# Altium project Knobber.PrjPcb
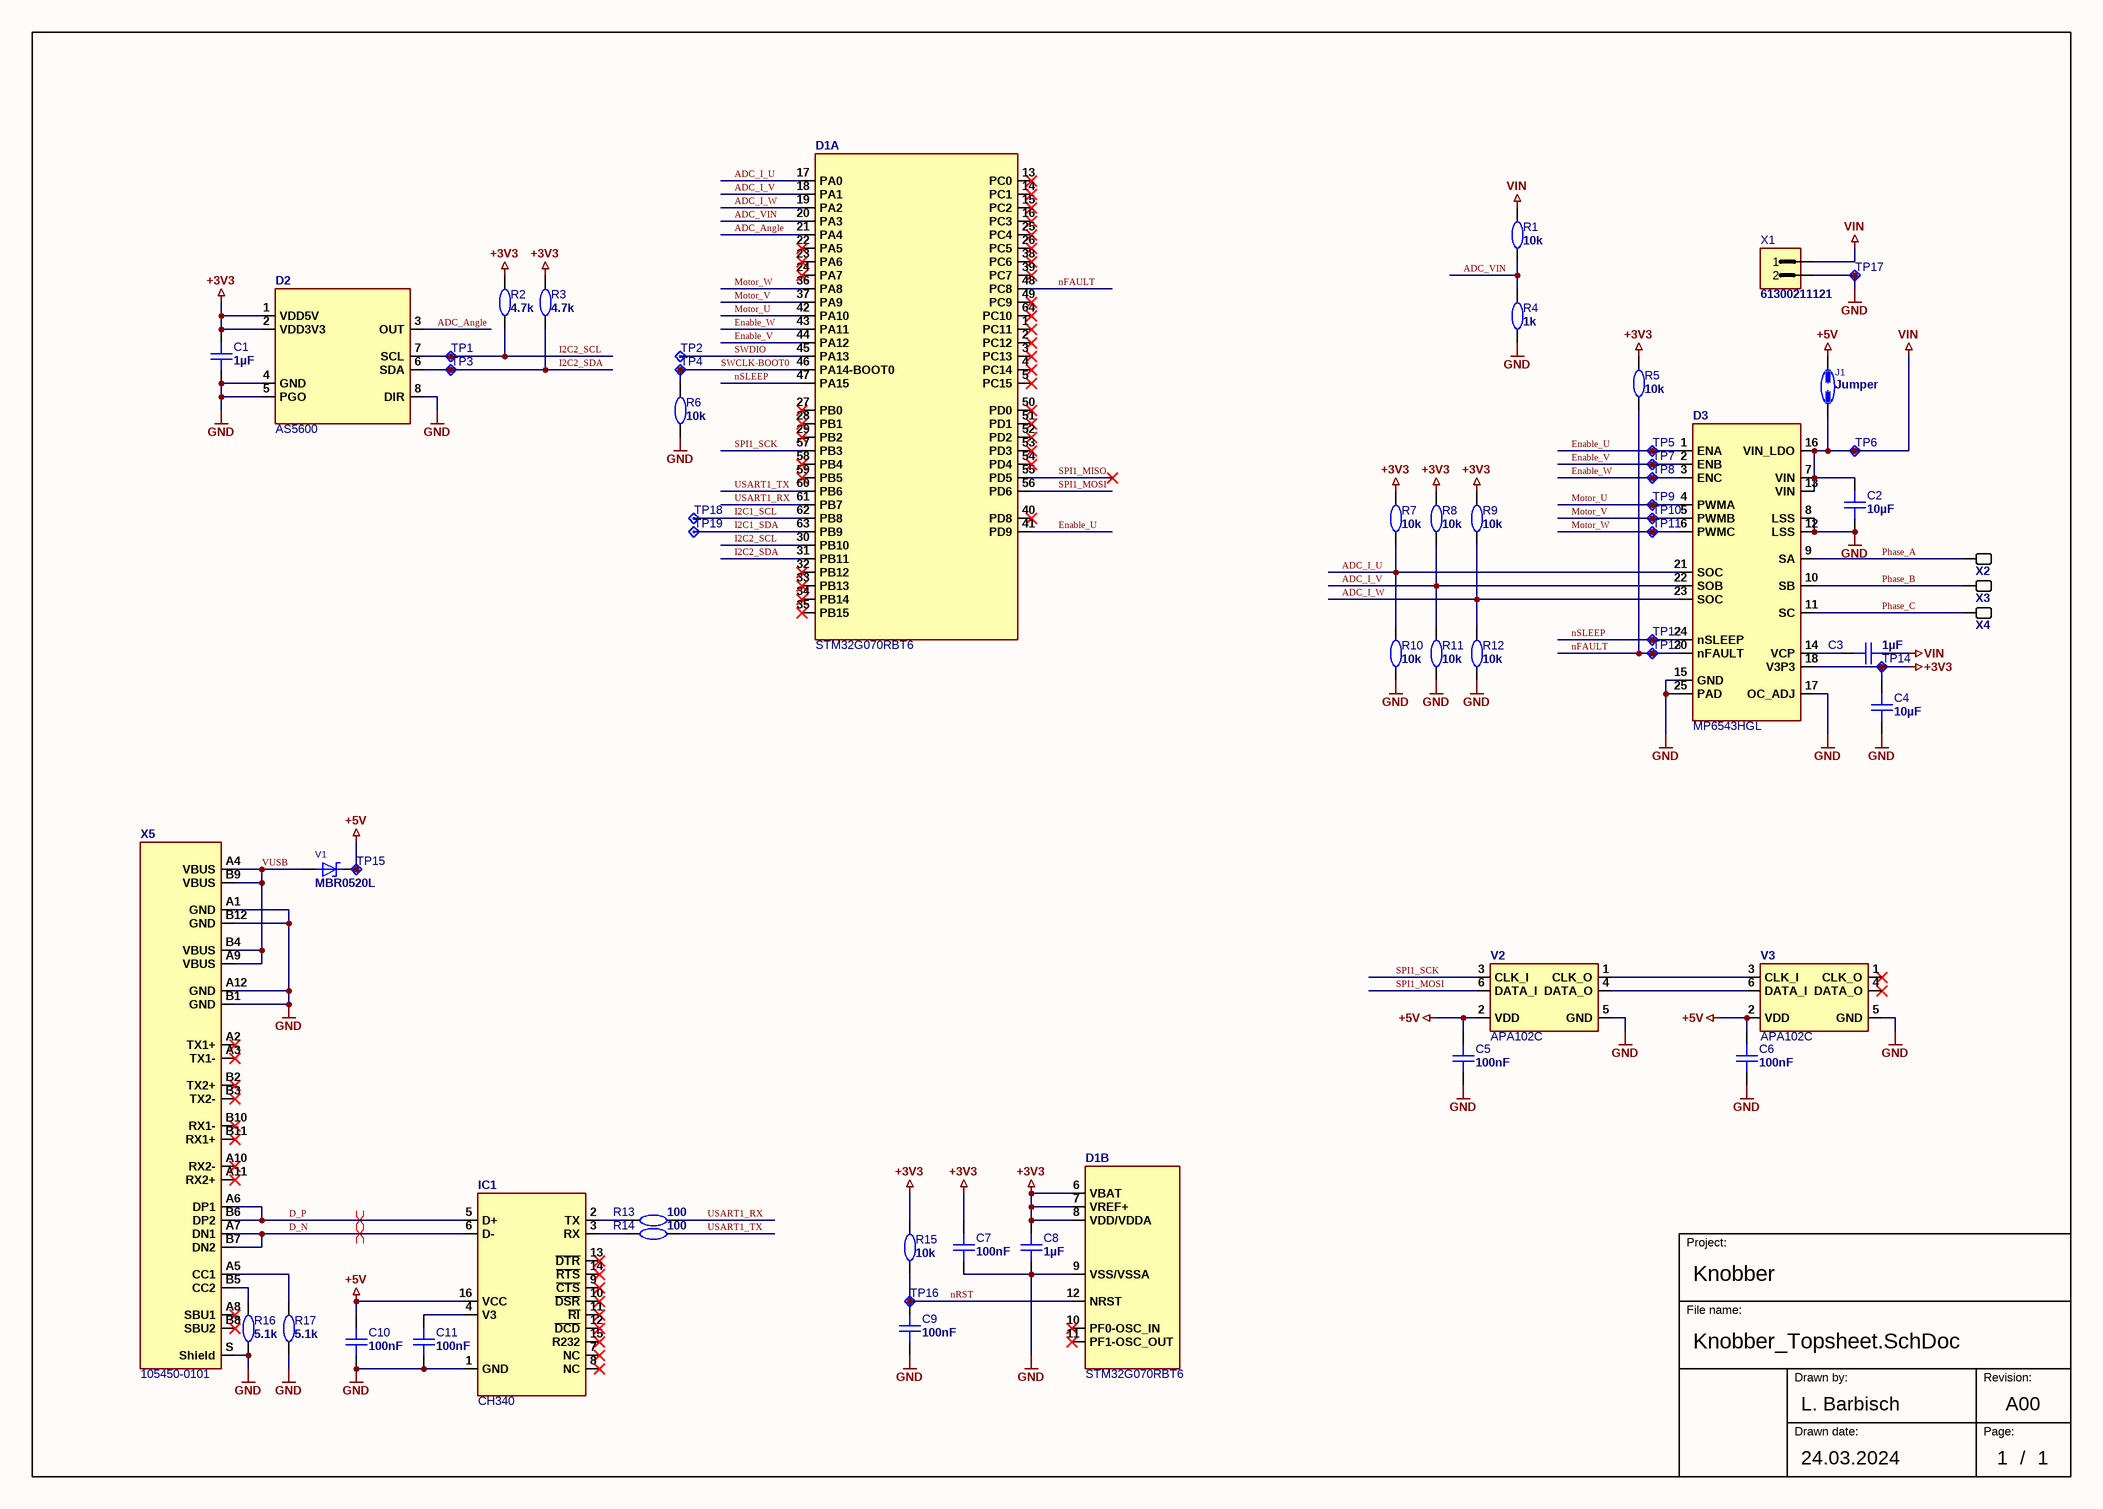
[diagram p0: Knobber_Topsheet.SchDoc]
Schematic_Title: Knobber; Schematic_Revision: A00; Schematic_DrawnDate: 24.03.2024; Schematic_DrawnBy: L. Barbisch; Schematic_DocumentNo: XXXXXXXX; Schematic_CheckedDate: dd.mm.yyyy; Schematic_CheckedBy: C. Sch Checker; Revision: A00; Project: Knobber; PCB_TP_Revision: A; PCB_TP_DocumentNo: XXXXXXXX; PCB_Title: Knobber; PCB_Revision: A; PCB_PartNo: XXX.XXXX; PCB_DrawnDate: dd.mm.yyyy; PCB_DrawnBy: D. Designer; PCB_CheckedDate: dd.mm.yyyy; PCB_CheckedBy: C. PCB Checker; PCB_Assy_DrawnDate: dd.mm.yyyy; PCB_Assy_DrawnBy: A. P. Assy
1 sheet, 60 parts. Net scope: global (net labels, ports and power ports of the same name join across sheets).
Board file: Knobber.PcbDoc

## Sheet Knobber_Topsheet.SchDoc
size A3; SheetNumber: 1; SheetTotal: 1

### Parts
C1  value 1µF  [C-0603_1608_095_L_RF]  (hidden comment: Cap 1u 0603)
C2  value 10µF  [C-1210_3225_230_L_RF]  (hidden comment: CAP 10u 1210)
C3  value 1µF  [C-0603_1608_095_L_RF]  (hidden comment: Cap 1u 0603)
C4  value 10µF  [C-0805_2012_145_L_RF]  (hidden comment: CAP 10u 16V 0805)
C5  value 100nF  [C-0603_1608_095_L_RF]  (hidden comment: Cap 100n 0603)
C6  value 100nF  [C-0603_1608_095_L_RF]  (hidden comment: Cap 100n 0603)
C7  value 100nF  [C-0603_1608_095_L_RF]  (hidden comment: Cap 100n 0603)
C8  value 1µF  [C-0603_1608_095_L_RF]  (hidden comment: Cap 1u 0603)
C9  value 100nF  [C-0603_1608_095_L_RF]  (hidden comment: Cap 100n 0603)
C10  value 100nF  [C-0603_1608_095_L_RF]  (hidden comment: Cap 100n 0603)
C11  value 100nF  [C-0603_1608_095_L_RF]  (hidden comment: Cap 100n 0603)
D1  STM32G070RBT6  [LQFP64_50P1200X1200X160-64N]  (parts A,B of 2)
D2  AS5600  [SOIC8_N_RF]
D3  MP6543HGL  [QFN24_5x7_N_RF]
IC1  CH340  [SOIC16_N_RF]
J1  value Jumper  [J-1206_Solderjumper_2Pin]  (hidden comment: Solder jumper 2Pin)  (no BOM)
R1  value 10k  [R-0603_1608_050_L_RF]  (hidden comment: Res 10k 0603)
R2  value 4.7k  [R-0603_1608_050_L_RF]  (hidden comment: Res 4k7 0603)
R3  value 4.7k  [R-0603_1608_050_L_RF]  (hidden comment: Res 4k7 0603)
R4  value 1k  [R-0603_1608_050_L_RF]  (hidden comment: Res 1k 0603)
R5  value 10k  [R-0603_1608_050_L_RF]  (hidden comment: Res 10k 0603)
R6  value 10k  [R-0603_1608_050_L_RF]  (hidden comment: Res 10k 0603)
R7  value 10k  [R-0603_1608_050_L_RF]  (hidden comment: Res 10k 0603)
R8  value 10k  [R-0603_1608_050_L_RF]  (hidden comment: Res 10k 0603)
R9  value 10k  [R-0603_1608_050_L_RF]  (hidden comment: Res 10k 0603)
R10  value 10k  [R-0603_1608_050_L_RF]  (hidden comment: Res 10k 0603)
R11  value 10k  [R-0603_1608_050_L_RF]  (hidden comment: Res 10k 0603)
R12  value 10k  [R-0603_1608_050_L_RF]  (hidden comment: Res 10k 0603)
R13  value 100  [R-0603_1608_050_L_RF]  (hidden comment: Res 100R 0603)
R14  value 100  [R-0603_1608_050_L_RF]  (hidden comment: Res 100R 0603)
R15  value 10k  [R-0603_1608_050_L_RF]  (hidden comment: Res 10k 0603)
R16  value 5.1k  [R-0603_1608_050_L_RF]  (hidden comment: Res 5k1 0603)
R17  value 5.1k  [R-0603_1608_050_L_RF]  (hidden comment: Res 5k1 0603)
TP1  TestPoint 0.8mm  [TP_0.8mm]  (value not drawn)  (no BOM)
TP2  TestPoint 0.8mm  [TP_0.8mm]  (value not drawn)  (no BOM)
TP3  TestPoint 0.8mm  [TP_0.8mm]  (value not drawn)  (no BOM)
TP4  TestPoint 0.8mm  [TP_0.8mm]  (value not drawn)  (no BOM)
TP5  TestPoint 0.8mm  [TP_0.8mm]  (value not drawn)  (no BOM)
TP6  TestPoint 0.8mm  [TP_0.8mm]  (value not drawn)  (no BOM)
TP7  TestPoint 0.8mm  [TP_0.8mm]  (value not drawn)  (no BOM)
TP8  TestPoint 0.8mm  [TP_0.8mm]  (value not drawn)  (no BOM)
TP9  TestPoint 0.8mm  [TP_0.8mm]  (value not drawn)  (no BOM)
TP10  TestPoint 0.8mm  [TP_0.8mm]  (value not drawn)  (no BOM)
TP11  TestPoint 0.8mm  [TP_0.8mm]  (value not drawn)  (no BOM)
TP12  TestPoint 0.8mm  [TP_0.8mm]  (value not drawn)  (no BOM)
TP13  TestPoint 0.8mm  [TP_0.8mm]  (value not drawn)  (no BOM)
TP14  TestPoint 0.8mm  [TP_0.8mm]  (value not drawn)  (no BOM)
TP15  TestPoint 0.8mm  [TP_0.8mm]  (value not drawn)  (no BOM)
TP16  TestPoint 0.8mm  [TP_0.8mm]  (value not drawn)  (no BOM)
TP17  TestPoint 0.8mm  [TP_0.8mm]  (value not drawn)  (no BOM)
TP18  TestPoint 0.8mm  [TP_0.8mm]  (value not drawn)  (no BOM)
TP19  TestPoint 0.8mm  [TP_0.8mm]  (value not drawn)  (no BOM)
V1  MBR0520L  [SOD123_L_RF]
V2  APA102C  [V_2020_P6_N_RF]
V3  APA102C  [V_2020_P6_N_RF]
X1  value 61300211121  [X-0508X0254_R_WE_61300211121]  (hidden comment: CONN HEADER 2POS 1ROW THT 2.54MM)
X2  (no value)  [Lötpad_2x3]  (no BOM)
X3  (no value)  [Lötpad_2x3]  (no BOM)
X4  (no value)  [Lötpad_2x3]  (no BOM)
X5  105450-0101  [105450-0101]

### Nets
+3V3: C1.2 C4.2 C7.2 C8.2 D1.6(VBAT) D1.7(VREF+) D1.8(VDD/VDDA) D2.1(VDD5V) D2.2(VDD3V3) D3.18(V3P3) R2.2 R3.2 R5.2 R7.2 R8.2 R9.2 R15.1 TP14.1
+5V: C5.2 C6.2 C10.2 IC1.16(VCC) J1.2 TP15.1 V1.2 V2.2(VDD) V3.2(VDD)
GND: C1.1 C2.1 C4.1 C5.1 C6.1 C7.1 C8.1 C9.1 C10.1 C11.1 D1.9(VSS/VSSA) D2.4(GND) D2.5(PGO) D2.8(DIR) D3.8(LSS) D3.12(LSS) D3.15(GND) D3.17(OC_ADJ) D3.25(PAD) IC1.1(GND) R4.1 R6.1 R10.1 R11.1 R12.1 R16.1 R17.1 TP17.1 V2.5(GND) V3.5(GND) X1.2 X5.A1(GND) X5.A12(GND) X5.B1(GND) X5.B12(GND) X5.S(Shield)
VIN: C2.2 C3.2 D3.7(VIN) D3.13(VIN) D3.16(VIN_LDO) J1.1 R1.2 TP6.1 X1.1
ADC_Angle: D1.21(PA4) D2.3(OUT)
ADC_I_U: D1.17(PA0) D3.21(SOC) R7.1 R10.2
ADC_I_V: D1.18(PA1) D3.22(SOB) R8.1 R11.2
ADC_I_W: D1.19(PA2) D3.23(SOC) R9.1 R12.2
ADC_VIN: D1.20(PA3) R1.1 R4.2
D_N: IC1.6(D-) X5.A7(DN1) X5.B7(DN2)
D_P: IC1.5(D+) X5.A6(DP1) X5.B6(DP2)
Enable_U: D1.41(PD9) D3.1(ENA) TP5.1
Enable_V: D1.44(PA12) D3.2(ENB) TP7.1
Enable_W: D1.43(PA11) D3.3(ENC) TP8.1
I2C1_SCL: D1.62(PB8) TP18.1
I2C1_SDA: D1.63(PB9) TP19.1
I2C2_SCL: D1.30(PB10) D2.7(SCL) R2.1 TP1.1
I2C2_SDA: D1.31(PB11) D2.6(SDA) R3.1 TP3.1
Motor_U: D1.42(PA10) D3.4(PWMA) TP9.1
Motor_V: D1.37(PA9) D3.5(PWMB) TP10.1
Motor_W: D1.36(PA8) D3.6(PWMC) TP11.1
nFAULT: D1.48(PC8) D3.20(nFAULT) R5.1 TP13.1
nRST: C9.2 D1.12(NRST) R15.2 TP16.1
nSLEEP: D1.47(PA15) D3.24(nSLEEP) TP12.1
Phase_A: D3.9(SA) X2.1
Phase_B: D3.10(SB) X3.1
Phase_C: D3.11(SC) X4.1
SPI1_MISO: D1.55(PD5)
SPI1_MOSI: D1.56(PD6) V2.6(DATA_I)
SPI1_SCK: D1.57(PB3) V2.3(CLK_I)
SWCLK-BOOT0: D1.46(PA14-BOOT0) R6.2 TP4.1
SWDIO: D1.45(PA13) TP2.1
USART1_RX: D1.61(PB7) R13.2
USART1_TX: D1.60(PB6) R14.2
VUSB: V1.1 X5.A4(VBUS) X5.A9(VBUS) X5.B4(VBUS) X5.B9(VBUS)
NetC3_1: C3.1 D3.14(VCP)
NetC11_2: C11.2 IC1.4(V3)
NetIC1_2: IC1.2(TX) R13.1
NetIC1_3: IC1.3(RX) R14.1
NetR16_2: R16.2 X5.B5(CC2)
NetR17_2: R17.2 X5.A5(CC1)
NetV2_1: V2.1(CLK_O) V3.3(CLK_I)
NetV2_4: V2.4(DATA_O) V3.6(DATA_I)

Not connected (* = marked no-connect by the designer): D1 1(PC11)* 2(PC12)* 3(PC13)* 4(PC14)* 5(PC15)* 10(PF0-OSC_IN)* 11(PF1-OSC_OUT)* 13(PC0)* 14(PC1)* 15(PC2)* 16(PC3)* 22(PA5)* 23(PA6)* 24(PA7)* 25(PC4)* 26(PC5)* 27(PB0)* 28(PB1)* 29(PB2)* 32(PB12)* 33(PB13)* 34(PB14)* 35(PB15)* 38(PC6)* 39(PC7)* 40(PD8)* 49(PC9)* 50(PD0)* 51(PD1)* 52(PD2)* 53(PD3)* 54(PD4)* 58(PB4)* 59(PB5)* 64(PC10)*; IC1 7(NC)* 8(NC)* 9(~{CTS})* 10(~{DSR})* 11(~{RI})* 12(~{DCD})* 13(~{DTR})* 14(~{RTS})* 15(R232)*; V3 1(CLK_O)* 4(DATA_O)*; X5 A2(TX1+)* A3(TX1-)* A8(SBU1)* A10(RX2-)* A11(RX2+)* B2(TX2+)* B3(TX2-)* B8(SBU2)* B10(RX1-)* B11(RX1+)*

### Layout directives
differential pair: D_N, D_P

### Notes on the sheet
- Project:
- File name:
- Drawn by:
- Revision:
- Drawn date:
- Page:
- /

### Library data of the parts
C1 C3 C8 = CMP-001-0045-3: Cap Cer SMD 1u 16V 10% 0603 X7R; Manufacturer Part Number: 0603YC105KAT2A; Manufacturer: AVX; GPV_Number: 1749.0125; User: epph; Prefered: true; Manufacturer Part Number 2: C0603C105K4RACTU; ClassName: Surface_Assy; Technology: SMT; Manufacturer 2: KEMET; PartStatus: Release; Case / Package: 0603
C2 = CMP-001-0198-2: CAP CER 10uF 50V X7S 1210; Manufacturer: TDK; Manufacturer Part Number: C3225X7S1H106K250AE; User: zupa; GPV_Number: 1752.0100; Technology: SMT; ClassName: Surface_Assy; ComponentLink1Description: Datasheet; PartStatus: Release; ComponentLink1URL: https://datasheet.ciiva.com/24218/c3225x7s1h106k250ae-265440-24218657.pdf?src-supplier=Mouser; Case / Package: 1210
C4 = CMP-001-0177-2: Cap Cer SMD 10u 16V 10% 0805 X5R; Manufacturer Part Number: 0805YD106KAT2A; Manufacturer: AVX; Prefered: true; GPV_Number: 1750.0241; User: zupa; PartStatus: Release; ComponentLink1URL: https://datasheet.ciiva.com/152/cx5r-152114.pdf; Case / Package: 0805; ComponentLink1Description: Datasheet; Technology: SMT; ClassName: Surface_Assy
C5-C7 C9-C11 = CMP-001-0036-2: Cap Cer SMD 100n 100V 10% 0603 X7R; Manufacturer Part Number: GRM188R72A104KA35; Manufacturer: MURATA; GPV_Number: 1749.0196; User: zupa; Prefered: false; Case / Package: 0603; ComponentLink1Description: Datasheet; PartStatus: Release; ComponentLink1URL: https://datasheet.ciiva.com/34302/1857815-34302863.pdf; ClassName: Surface_Assy; Technology: SMT
D1 = STM32G070RBT6: IC MCU Cortex M0+ 128k Flash, 36k RAM, 64MHz; Part_validated: No; Manufacturer: ST; GPV_Number: xxxx.xxxx; MNL_Number: xxxxxxxx; Value: STM32G070RBT6; Footprint_validated: No; PartStatus: New; System: -; ClassName: Surface_Assy; Case/Package: QFP64; Technology: SMT; Manufacturer Part Number: STM32G070RBT6
D2 = AS5600: IC Sensor Rotation Magnet 12bit; Part_validated: No; Manufacturer: AMS; GPV_Number: xxxx.xxxx; MNL_Number: xxxxxxxx; Value: AS5600; Footprint_validated: No; PartStatus: New; System: -; ClassName: Surface_Assy; Case/Package: SO-8; Technology: SMT; Manufacturer Part Number: AS5600
D3 = MP6543HGL-A-P: Motor Driver 3-Phase 3-22V 2A; Part_validated: No; Manufacturer: Monolithic Power Systems; GPV_Number: xxxx.xxxx; MNL_Number: xxxxxxxx; Value: MP6543HGL; Footprint_validated: No; PartStatus: New; System: -; ClassName: Surface_Assy; Case/Package: QFN-24; Technology: SMT; Manufacturer Part Number: MP6543HGL-A-P
IC1 = CH340C: IC Converter USB UART; Part_validated: No; Manufacturer: WCN; GPV_Number: xxxx.xxxx; MNL_Number: xxxxxxxx; Value: CH340; Footprint_validated: No; PartStatus: New; System: -; ClassName: Surface_Assy; Case/Package: SO16; Technology: SMT; Manufacturer Part Number: CH340C
J1 = CMP-00136-2: User: epph; PartStatus: Release; ClassName: Surface_Assy; Technology: SYM
R1 R5-R12 R15 = CMP-001-0241-3: Res SMD 10k 1% 0.1W 0603; Manufacturer: YAGEO; Manufacturer Part Number: RC0603FR-0710KL; MNL_Number: 15310022; GPV_Number: 1922.0100; User: zupa; Prefered: true; Case / Package: 0603; ClassName: Surface_Assy; PartStatus: Release; ComponentLink1URL: https://datasheet.ciiva.com/11808/0900766b80f96399-11808280.pdf; ComponentLink1Description: Datasheet; Technology: SMT
R2 R3 = CMP-001-0274-3: Res SMD 4k7 1% 0.1W 0603; Manufacturer Part Number: RC0603FR-074K7L; Manufacturer: YAGEO; GPV_Number: 1922.0017; Prefered: true; MNL_Number: 15347012; User: zupa; ComponentLink1Description: Datasheet; ComponentLink1URL: https://datasheet.ciiva.com/11808/0900766b80f96399-11808280.pdf; ClassName: Surface_Assy; PartStatus: Release; Case / Package: 0603; Technology: SMT
R4 = CMP-001-0250-3: Res SMD 1k 1% 0.1W 0603; Manufacturer: YAGEO; Manufacturer Part Number: RC0603FR-071KL; MNL_Number: 15310012; User: zupa; GPV_Number: 1922.0011; Prefered: true; Technology: SMT; ComponentLink1Description: Datasheet; ClassName: Surface_Assy; ComponentLink1URL: https://datasheet.ciiva.com/11808/0900766b80f96399-11808280.pdf; Case / Package: 0603; PartStatus: Release
R13 R14 = CMP-001-0240-3: Res SMD 100R 1% 0.1W 0603; Manufacturer: YAGEO; Manufacturer Part Number: RC0603FR-07100RL; Prefered: true; User: zupa; MNL_Number: 15310004; GPV_Number: 1922.0102; ClassName: Surface_Assy; Case / Package: 0603; ComponentLink1Description: Datasheet; Technology: SMT; ComponentLink1URL: https://datasheet.ciiva.com/11808/0900766b80f96399-11808280.pdf; PartStatus: Release
R16 R17 = CMP-001-0582-3: Res SMD 5k1 1% 0.1W 0603; Manufacturer Part Number: RC0603FR-075K1L; Manufacturer: YAGEO; Prefered: true; GPV_Number: 1922.0144; User: napa; Technology: SMT; ComponentLink1URL: https://datasheet.ciiva.com/8895/pyu-rc0603-51-rohs-l-4-8895189.pdf; PartStatus: Release; ClassName: Surface_Assy; ComponentLink1Description: Datasheet; Case / Package: 0603
TP1-TP19 = CMP-001-1515-1: Value: TP; User: zupa; ClassName: Testpoint; GPV_Number: -; PartStatus: Release; Technology: SMT
V1 = CMP-001-1324-3: Diode Schottky 20V 0.5A SOD123; Manufacturer: ONSemi; Manufacturer Part Number: MBR0520LT1G; GPV_Number: 1600.2395; User: epph; Prefered: false; Technology: SMT; ClassName: Surface_Assy; PartStatus: Release; Value: MBR0520L; Case / Package: SOD123
V2 V3 = APA102C: RGB LED SPI Interface; Part_validated: No; Manufacturer: APA Electronic CO; Manufacturer Part Number: APA-102-2020-256-8A; GPV_Number: xxxx.xxxx; MNL_Number: xxxxxxxx; Value: APA102C; Footprint_validated: No; PartStatus: New; System: -; ClassName: Surface_Assy; Case/Package: 2020; Technology: SMT
X1 = CMP-00105-2: CONN HEADER 2POS 1ROW THT 2.54MM WE 61300211121; System: Connector; User: balu; ComponentLink1URL: https://www.we-online.com/katalog/datasheet/6130xx11121.pdf; Manufacturer Part Number: 61300211121; ComponentLink1Description: Datasheet; GPV_Number: *; PartStatus: Release; Technology: THT; ClassName: Through-Hole_Assy; Manufacturer: WE
X2-X4 = Lötpad_2mmx3mm: Solderpad 2mm x 3mm; Part_validated: No; GPV_Number: xxxx.xxxx; System: Connector; MNL_Number: xxxxxxxx; Footprint_validated: No; PartStatus: New; ClassName: Testpoint; Case/Package: -; Technology: SMT; Manufacturer: -; Manufacturer Part Number: -
X5 = 105450-0101: CONN USB-C 16pin; Part_validated: No; Manufacturer: Molex; GPV_Number: xxxx.xxxx; System: Connector; MNL_Number: xxxxxxxx; Value: 105450-0101; Footprint_validated: No; PartStatus: New; ClassName: Through-Hole_Assy; Case/Package: USB-C; Technology: SMT; Manufacturer Part Number: 105450-0101

## Assembly variants
951.xxxx: all parts fitted